# EasyEDA Pro project ProPrj_雁过留痕_2026-07-08.epro, board PCB2
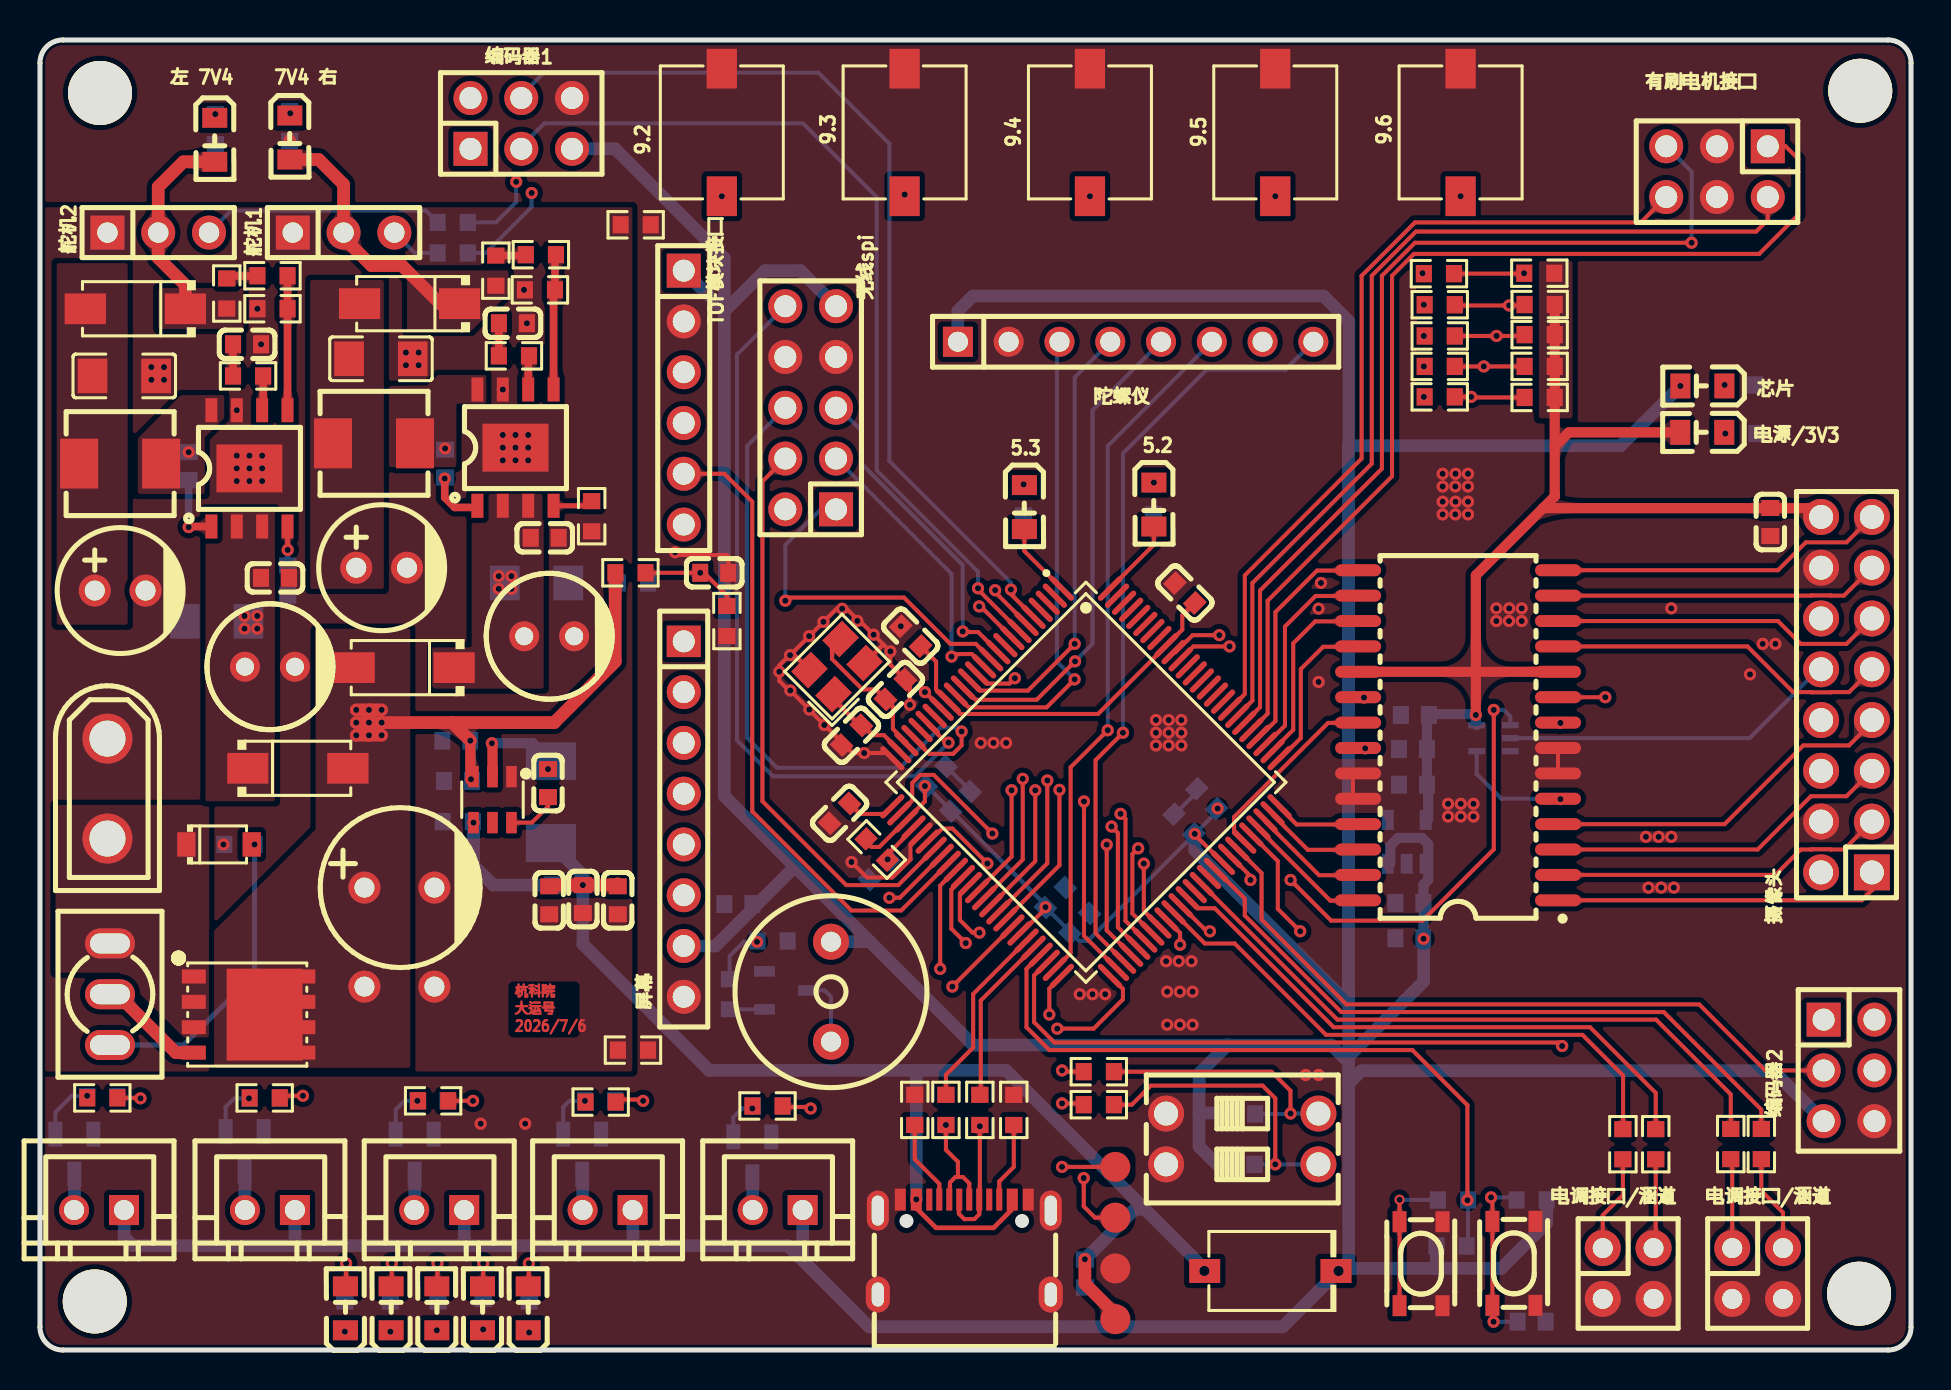
[diagram p4: board, top side]
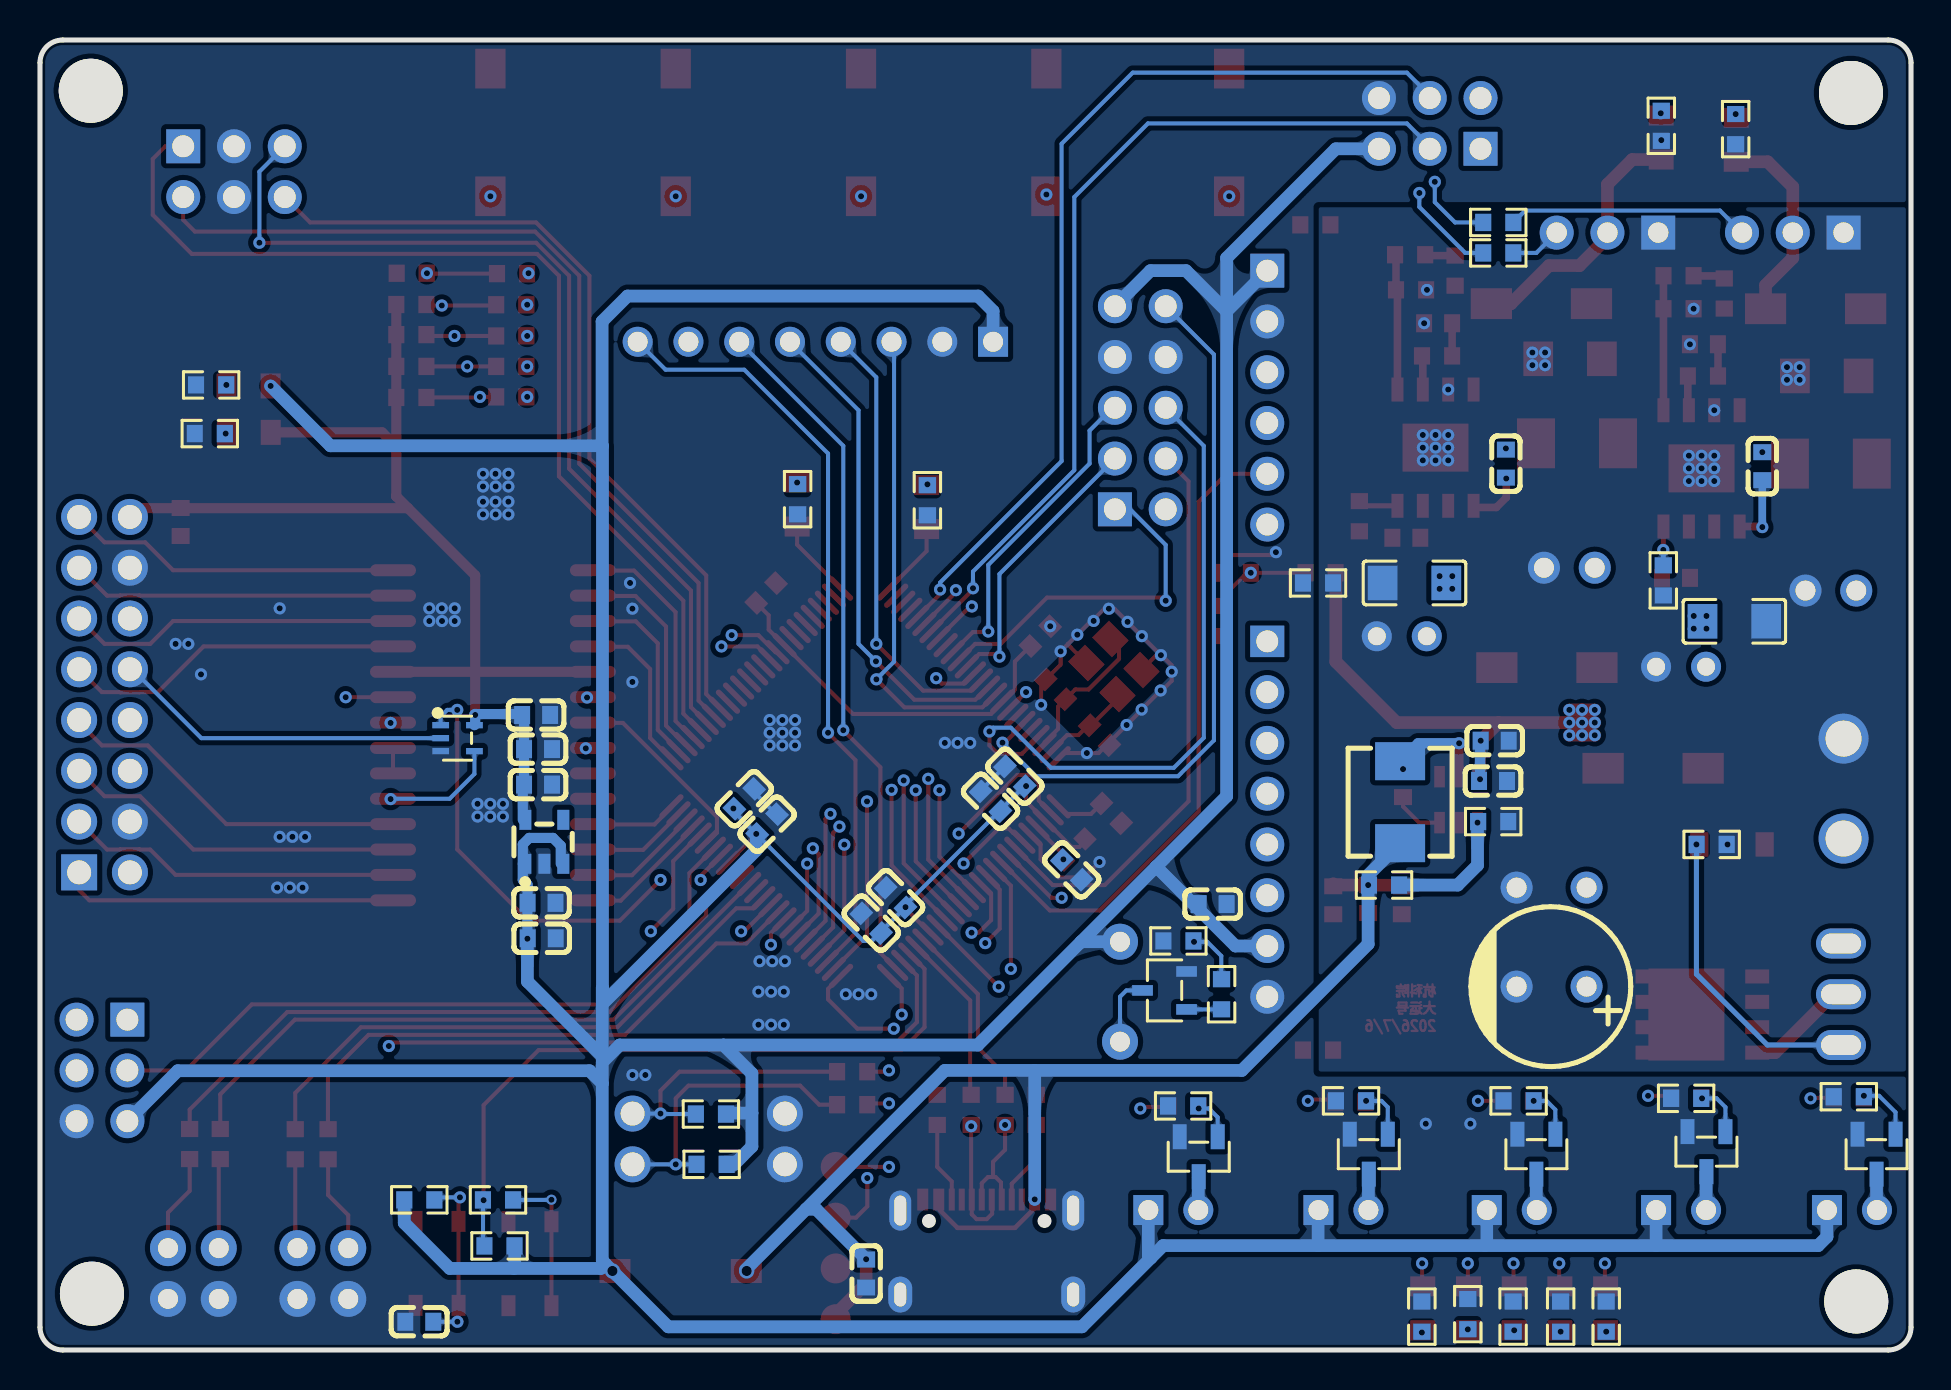
[diagram p5: board, bottom side, seen from below]

Outline 93.6 x 65.53 mm; copper layers: Top Layer, Inner1, Inner2, Bottom Layer. Coordinates in mm from the lower left corner of the outline.
Outline path: 0,64.39 0,1.14 arc(0.33,0.33) 1.14,0 92.46,0 arc(93.26,0.33) 93.6,1.14 93.6,64.39 arc(93.26,65.2) 92.46,65.53 1.14,65.53 arc(0.33,65.2) 0,64.39
Stack: Top Layer 0.035mm Outer layer thickness 1oz / Dielectric1 0.2104mm 7628 RC49% 8.6mil / Inner1 0.0152mm Inner layer thickness / Dielectric2 1.065mm 1.1mm H/HOZ Copper / Inner2 0.0152mm Inner layer thickness / Dielectric3 0.2104mm 7628 RC49% 8.6mil / Bottom Layer 0.035mm Outer layer thickness 1oz

## Design rules (mm)
spacing copperThickness1oz (default): track to track 0.102, other pairs 0.152 to 0.3
spacing copperThickness2oz: track to track 0.203, other pairs 0.152 to 0.3
track width copperThickness1oz (default): min 0.127, default 0.254, max 2.54
track width copperThickness2oz: min 0.203, default 0.254, max 2.54
differential pair differentialPair (default): width min 0.127, default 0.254, max 2.54; gap min 0.152, default 0.152
net VCC7.4V uses copperRegion
net AGND uses copperRegion
net GND uses copperRegion
net VCCBAT uses copperRegion
net $2N48 uses copperRegion
net $2N49 uses copperRegion
net 8.4 uses copperRegion
net 0.0 uses copperRegion
net VCC3V3 uses copperRegion
net $2N1719 uses copperRegion
net $2N1717 uses copperRegion
net $2N1720 uses copperRegion
net VCC7.4 uses copperRegion

## Placement (name value [footprint] x y rotation side)
3V4  -  [LED_0805]  15.28 2.14 90 top
3V5  -  [LED_0805]  24.43 2.14 90 top
3V6  -  [LED_0805]  19.86 2.14 90 top
3V7  -  [LED_0805]  17.57 2.14 90 top
3V8  -  [LED_0805]  22.14 2.14 90 top
5.2  -  [LED_0805]  55.72 42.24 270 top
5.3  -  [LED_0805]  49.24 42.12 270 top
7V4 右  -  [LED_0805]  12.49 60.6 270 top
9.2  TSB06341-050W811WA-R1000  [SW-SMD_L6.0-W6.0-LS6.6]  34.11 60.91 90 top
9.3  TSB06341-050W811WA-R1000  [SW-SMD_L6.0-W6.0-LS6.6]  43.25 60.91 90 top
9.4  TSB06341-050W811WA-R1000  [SW-SMD_L6.0-W6.0-LS6.6]  52.52 60.91 90 top
9.5  TSB06341-050W811WA-R1000  [SW-SMD_L6.0-W6.0-LS6.6]  61.8 60.91 90 top
9.6  TSB06341-050W811WA-R1000  [SW-SMD_L6.0-W6.0-LS6.6]  71.07 60.91 90 top
BUZZER1  3kHz  [BUZ-TH_BD9.6-P5.00-D0.7-FD]  39.57 17.92 270 top
C1  10UF  [C0603]  43.56 35.71 315 top
C2  100nF  [C0603]  41.98 24.02 45 bottom
C3  10uF  [C0603]  46.05 27.45 225 bottom
C4  100nF  [C0603]  44.83 28.7 225 bottom
C5  10uF  [C0603]  58.37 27.58 135 bottom
C6  100nF  [C0603]  57.22 26.31 135 bottom
C7  10UF  [C0603]  40 26.85 45 top
C8  10uF  [C0603]  52.02 21.35 45 bottom
C9  100nF  [C0603]  50.8 22.63 45 bottom
C10  100nF  [C0603]  68.78 31.77 0 bottom
C11  100nF  [C0603_5]  86.56 41.42 90 top
C12  100nF  [C0603]  34.94 22.31 0 bottom
C14  100nF  [C0603_1]  33.73 38.88 180 top
C18  4.7uF  [C1206]  24.84 38.37 0 bottom
C19  100nF  [C0603_3]  25.25 40.63 180 top
C20  100nF  [C0603_3]  20.27 44.34 270 bottom
C21  47uF  [C1206]  17.06 49.58 0 top
C22  4.7nf  [C0603_3]  23.66 51.36 0 top
C23  固态电容220uF  [CAP-TH_BD6.3-P2.50-D1.0-FD]  17.09 39.13 0 top
C24  100uF  [CAP-TH_BD6.3-P2.50-D0.5-FD_NPXC0571C101MF]  25.47 35.7 0 top
C32  100nF  [C0603_3]  68.51 22.37 0 bottom
C33  100nF  [C0603_3]  68.68 30.06 0 bottom
C34  22UF  [C0603_1]  25.47 22.5 90 top
C35  100nF  [C0603_1]  27.16 22.56 90 top
C36  100nF  [C0603_1]  25.41 28.36 270 top
C37  100nF  [C0603_4]  20.91 28.47 0 bottom
C38  100nF  [C0603_4]  20.83 30.48 0 bottom
C39  100nF  [C0603_1]  28.9 22.5 90 top
C44  4.7uF  [C1206]  8.84 36.45 180 bottom
C45  47uF  [C1206]  4.22 48.73 0 top
C46  100nF  [C0603_3]  11.76 38.62 180 top
C47  100nF  [C0603_3]  7.44 44.21 270 bottom
C48  4.7nf  [C0603_3]  10.36 50.31 0 top
C49  固态电容220uF  [CAP-TH_BD6.3-P2.50-D1.0-FD]  4.01 37.99 0 top
C50  100uF  [CAP-TH_BD6.3-P2.50-D0.5-FD_NPXC0571C101MF]  11.5 34.18 0 top
C107  100nF  [C0603_2]  74.62 1.41 180 bottom
C111  10UF  [C0603]  57.27 37.87 315 top
C112  100nF  [C0603_1]  40.59 30.75 225 top
C113  100nF  [C0603_1]  42.8 33.04 225 top
C151  100nF  [C0603_3]  68.68 28.28 0 bottom
C152  100nF  [C0603_1]  52.27 3.83 270 bottom
C153  100nF  [C0603_3]  68.5 20.6 0 bottom
CN1  HX-XH2.54-2PZZ  [CONN-TH_2P-P2.50_HX-2.54MM-2P-ZZ-MS]  19.97 7 180 top
CN2  HX-XH2.54-2PZZ  [CONN-TH_2P-P2.50_HX-2.54MM-2P-ZZ-MS]  2.95 7 180 top
CN3  HX-XH2.54-2PZZ  [CONN-TH_2P-P2.50_HX-2.54MM-2P-ZZ-MS]  11.5 7 180 top
CN4  XT30UPB-M  [CONN-TH_XT30UPB-M]  3.38 28.08 270 top
CN7  HX-XH2.54-2PZZ  [CONN-TH_2P-P2.50_HX-2.54MM-2P-ZZ-MS]  36.9 7 180 top
CN8  HX-XH2.54-2PZZ  [CONN-TH_2P-P2.50_HX-2.54MM-2P-ZZ-MS]  28.39 7 180 top
D1  BZT52C16  [SOD-123_L2.7-W1.6-LS3.7-RD]  8.96 25.29 0 top
D2  SS54  [SMA_L4.4-W2.8-LS5.4-R-RD]  18.22 34.13 180 top
D3  SS54  [SMA_L4.4-W2.8-LS5.4-R-RD]  18.49 52.34 180 top
D6  SS54  [SMA_L4.4-W2.8-LS5.4-R-RD]  12.9 29.1 0 top
D7  SS54  [SMA_L4.4-W2.8-LS5.4-R-RD]  4.77 52.09 180 top
L1  10uH  [IND-SMD_L5.4-W5.2_FXL0530_1]  25.56 27.4 90 bottom
P2  Header-D-M 1x4P  [HDR1X4-TP]  53.79 9.16 270 top
Q1  AO3400A  [SOT-23-3_L2.9-W1.3-P1.90-LS2.4-BR]  18.74 9.8 90 bottom
Q2  AGM30P100A  [PDFN-8_L5.8-W4.9-P1.27-LS6.1-BL-A]  10.49 16.78 270 top
Q3  S8050  [SOT-23-3_L3.0-W1.7-P0.95-LS2.9-BR]  37.34 17.99 180 bottom
Q4  AO3400A  [SOT-23-3_L2.9-W1.3-P1.90-LS2.4-BR]  35.63 9.67 90 bottom
Q5  AO3400A  [SOT-23-3_L2.9-W1.3-P1.90-LS2.4-BR]  27.12 9.8 90 bottom
Q6  AO3400A  [SOT-23-3_L2.9-W1.3-P1.90-LS2.4-BR]  1.72 9.8 90 bottom
Q7  AO3400A  [SOT-23-3_L2.9-W1.3-P1.90-LS2.4-BR]  10.23 9.92 90 bottom
R1  0R  [R0603_3]  41.86 25.04 315 top
R2  10K  [R0603]  12.49 61.24 90 bottom
R3  10K  [R0603_9]  85.1 45.84 180 bottom
R4  10K  [R0603_9]  43.76 12.01 270 top
R5  10K  [R0603]  3.12 12.61 180 top
R6  10K  [R0603_9]  85.04 48.28 180 bottom
R7  470R  [R0603]  70.02 52.29 180 top
R8  470R  [R0603]  70.02 50.73 180 top
R9  470R  [R0603]  70.02 49.2 180 top
R10  470R  [R0603]  70.02 47.68 180 top
R11  22  [R0603]  45.32 12.01 90 top
R12  10K  [R0603_6]  70.61 5.21 180 bottom
R13  100R  [R0603_6]  70.69 7.51 0 bottom
R14  10K  [R0603_9]  48.71 12.01 270 top
R15  22  [R0603]  47.02 12.01 90 top
R16  4.7K  [R0603]  75.02 47.65 180 top
R17  0R  [R0603_3]  29.8 56.29 180 top
R19  4.7K  [R0603]  75.02 50.79 180 top
R21  100R  [R0603]  79.19 10.3 90 top
R22  100R  [R0603]  80.83 10.3 90 top
R23  10K  [R0603]  60.03 11.8 0 bottom
R26  10kΩ  [R0603_8]  9.97 25.29 0 bottom
R27  200K  [R0603]  27.6 41.71 90 top
R28  20K  [R0603]  23.71 49.73 180 top
R29  10K  [R0603_5]  74.62 7.51 180 bottom
R30  1K5  [R0603]  22.81 53.99 90 top
R31  51K  [R0603]  25.06 54.79 0 top
R32  10K  [R0603]  25.01 53.03 180 top
R38  22K  [R0603]  26.36 23.26 0 bottom
R39  3K  [R0603]  20.9 26.43 0 bottom
R40  10K  [R0603]  60 9.29 0 bottom
R41  10K  [R0603]  52.97 13.92 180 top
R42  10K  [R0603]  52.97 12.27 180 top
R43  200K  [R0603]  29.54 38.88 180 top
R44  20K  [R0603]  34.36 36.47 270 top
R46  100  [R0603]  20.65 54.88 0 bottom
R47  4.7K  [R0603]  75.02 49.2 180 top
R48  4.7K  [R0603]  75.02 52.3 180 top
R49  4.7K  [R0603]  75 53.86 180 top
R50  10K  [R0603]  19.67 12.47 180 top
R51  10k  [R0603_2]  19.63 12.46 0 bottom
R52  10K  [R0603]  34.49 17.8 270 bottom
R53  10k  [R0603_2]  36.65 20.46 180 bottom
R54  470R  [R0603]  69.98 53.84 180 top
R61  100  [R0603]  20.65 56.41 0 bottom
R62  100R  [R0603]  84.58 10.3 90 top
R63  100R  [R0603]  86.11 10.3 90 top
R64  200K  [R0603]  12.39 38.5 90 bottom
R65  20K  [R0603]  10.41 48.73 180 top
R66  1K5  [R0603]  9.34 52.85 90 top
R67  51K  [R0603]  11.63 53.74 0 top
R68  10K  [R0603]  11.63 52.09 180 top
R69  10K  [R0603]  8.77 61.07 90 bottom
R70  10k  [R0603_2]  3.11 12.67 0 bottom
R71  10K  [R0603]  11.24 12.61 180 top
R72  10k  [R0603_2]  11.25 12.59 0 bottom
R73  10K  [R0603_9]  49.2 42.51 90 bottom
R74  10K  [R0603_9]  55.7 42.56 90 bottom
R75  10K  [R0603_9]  15.25 1.67 270 bottom
R76  10K  [R0603_9]  17.53 1.67 270 bottom
R77  10K  [R0603_9]  22.17 1.79 270 bottom
R78  10K  [R0603_9]  24.47 1.67 270 bottom
R79  10K  [R0603_9]  19.91 1.67 270 bottom
R80  10K  [R0603]  36.4 12.21 180 top
R81  10k  [R0603_2]  36.41 12.21 0 bottom
R82  10K  [R0603]  28.05 12.4 180 top
R83  10k  [R0603_2]  28.01 12.46 0 bottom
R92  0R  [R0603_3]  29.66 38.37 180 bottom
R193  0R  [R0603_3]  29.66 15 180 top
SCREW1  -  [M3螺丝]  3 62.88 0 top
SCREW2  -  [M3螺丝]  91.06 62.99 0 top
SCREW3  -  [M3螺丝]  2.74 2.43 0 top
SCREW4  -  [M3螺丝]  91 2.82 0 top
SW1  DSWB02LHGET  [SW-TH_DSWB02LHGET]  60.14 10.56 270 top
SW31  TSA016A2526B  [KEY-SMD_4P-L4.2-W3.4-P2.15-LS4.5-TL]  73.73 4.34 90 top
SW44  TS-1089A-B3D4  [KEY-SMD_2P-L6.0-W3.8-LS7.30-L]  61.55 3.95 180 top
SW45  TSA016A2526B  [KEY-SMD_4P-L4.2-W3.4-P2.15-LS4.5-TL]  69.09 4.32 90 top
TOF模块接口  PZ254V-11-06P  [HDR-TH_6P-P2.54-V-M]  32.2 47.64 270 top
U1  STC32G144K246_LQFP100  [STC32G144K246LQFP-100(16x16)]  52.32 28.4 225 top
U3  -  [SOP-28_L17.9-W7.1-P1.27-LS10.3-BL]  70.94 30.75 90 top
U6  ST-0-102-A01-T000-LF+PJ  [SW-TH_3P-L8.3-W5.2-P2.54_ST-0-102-A01-T000]  3.5 17.8 270 top
U9  SCT2450  [ESOP-8_L4.9-W3.9-P1.27-LS6.0-BL-EP]  23.79 45.14 0 top
U10  4.7uH  [IND-SMD_L5.4-W5.2_FXL0530]  16.71 45.36 180 top
U13  RT9013-33GB-MS  [SOT-23-5_L2.9-W1.6-P0.95-LS2.8-BR]  68.37 25.42 270 bottom
U15  470uF  [CAP-TH_BD8.0-P3.50-D0.6-FD]  17.98 18.18 0 bottom
U16  470uF  [CAP-TH_BD8.0-P3.50-D0.6-FD]  17.98 23.13 0 top
U17  TPS54302DDCR  [SOT-23-6_L2.9-W1.6-P0.95-LS2.8-BL]  22.64 27.53 180 top
U18  SN74LVC1G00DCKR  [SOT-353_L2.1-W1.3-P0.65-LS2.3-BR]  72.71 30.61 0 bottom
U20  SCT2450  [ESOP-8_L4.9-W3.9-P1.27-LS6.0-BL-EP]  10.48 44.1 0 top
U21  4.7uH  [IND-SMD_L5.4-W5.2_FXL0530]  4.01 44.34 180 top
USB1  TYPE-C 16PIN 2MD(073)  [USB-C-SMD_TYPE-C-6PIN-2MD-073]  46.24 5.15 0 top
X1  24MHz  [CRYSTAL-SMD_4P-L3.2-W2.5-BL]  39.87 34.19 45 top
屏幕  PM2.54-1X8PM-H85  [HDR-TH_8P-P2.54-V-F]  32.2 26.56 270 top
左 7V4  -  [LED_0805]  8.74 60.49 270 top
摄像头  摄像头  [HDR-TH_16P-P2.54-V-M-R2-C8-S2.54]  90.37 32.78 90 top
无线spi  PZ254V-12-10P  [HDR-TH_10P-P2.54-V-M-R2-C5-S2.54]  38.55 47.13 90 top
有刷电机接口  PZ254V-12-6P  [HDR-TH_6P-P2.54-V-M-R2-C3-S2.54_1]  83.89 58.94 180 top
电源/3V3  -  [LED_0805]  83.11 45.91 180 top
电调接口/涵道  -  [HDR-TH_4P-P2.54-V-F-R2-C2-S2.54]  85.93 3.83 270 top
电调接口/涵道#2  -  [HDR-TH_4P-P2.54-V-F-R2-C2-S2.54]  79.45 3.83 270 top
编码器1  PZ254V-12-6P  [HDR-TH_6P-P2.54-V-M-R2-C3-S2.54_1]  24.08 61.36 0 top
编码器2  PZ254V-12-6P  [HDR-TH_6P-P2.54-V-M-R2-C3-S2.54_1]  90.5 13.99 270 top
舵机1  PZ254V-11-03P  [HDR-TH_3P-P2.54-V-M_PZ254V-11-03P]  15.19 55.9 0 top
舵机2  PZ254V-11-03P  [HDR-TH_3P-P2.54-V-M_PZ254V-11-03P]  5.92 55.9 0 top
芯片  -  [LED_0805]  83.11 48.23 180 top
陀螺仪  陀螺仪  [HDR-TH_8P-P2.54-V-M]  54.81 50.44 0 top

## Footprints (pads in the part's own frame, mm; a bottom-side part is the same pattern mirrored in y, then rotated)
BUZ-TH_BD9.6-P5.00-D0.7-FD
  round 1.8 hole 1: 1(-2.5,0) 2(2.5,0)
C0603
  rect 0.8x0.9 smd: 1(-0.7,0) 2(0.7,0)
C0603_1
  rect 0.8x0.9 smd: 1(-0.7,0) 2(0.7,0)
C0603_2
  rect 0.8x0.9 smd: 1(-0.7,0) 2(0.7,0)
C0603_3
  rect 0.8x0.9 smd: 1(-0.7,0) 2(0.7,0)
C0603_4
  rect 0.8x0.9 smd: 1(-0.7,0) 2(0.7,0)
C0603_5
  rect 0.8x0.9 smd: 1(-0.7,0) 2(0.7,0)
C1206
  rect 1.485x1.728 smd: 1(-1.593,0) 2(1.593,0)
CAP-TH_BD6.3-P2.50-D0.5-FD_NPXC0571C101MF
  round 1.5 hole 0.9: 1(-1.25,0) 2(1.25,0)
CAP-TH_BD6.3-P2.50-D1.0-FD
  round 1.6 hole 1: 1(-1.27,0) 2(1.27,0)
CAP-TH_BD8.0-P3.50-D0.6-FD
  round 1.6 hole 1: 1(-1.75,0) 2(1.75,0)
CONN-TH_2P-P2.50_HX-2.54MM-2P-ZZ-MS
  rect 1.5x1.5 hole 1: 1(-1.25,0)
  round 1.5 hole 1: 2(1.25,0)
CONN-TH_XT30UPB-M
  round 2.5 hole 1.8: 1(-2.5,0) 2(2.5,0)
CRYSTAL-SMD_4P-L3.2-W2.5-BL
  rect 1.4x1.2 smd: 1(-1.1,-0.85) 2(1.1,-0.85) 3(1.1,0.85) 4(-1.1,0.85)
ESOP-8_L4.9-W3.9-P1.27-LS6.0-BL-EP
  rect 0.6x1.2 smd: 1(-1.905,-2.909) 2(-0.635,-2.909) 3(0.635,-2.909) 4(1.905,-2.909) 5(1.905,2.909) 6(0.635,2.909) 7(-0.635,2.909) 8(-1.905,2.909)
  rect 3.3x2.4 smd: 9(0,0)
HDR1X4-TP
  rrect 1.5x1.5 smd: 1(0,0)
  round 1.5 smd: 2(2.54,0) 3(5.08,0) 4(7.62,0)
HDR-TH_3P-P2.54-V-M_PZ254V-11-03P
  rect 1.7x1.7 hole 1.02: 1(-2.54,0)
  round 1.7 hole 1.02: 2(0,0) 3(2.54,0)
HDR-TH_4P-P2.54-V-F-R2-C2-S2.54
  round 1.8 hole 1: 1(-1.27,-1.27) 2(-1.27,1.27) 3(1.27,-1.27) 4(1.27,1.27)
HDR-TH_6P-P2.54-V-M
  rect 1.7x1.7 hole 1.1: 1(-6.35,0)
  round 1.7 hole 1.1: 2(-3.81,0) 3(-1.27,0) 4(1.27,0) 5(3.81,0) 6(6.35,0)
HDR-TH_6P-P2.54-V-M-R2-C3-S2.54_1
  rect 1.7x1.7 hole 1.1: 1(-2.54,-1.27)
  round 1.7 hole 1.1: 2(-2.54,1.27) 3(0,-1.27) 4(0,1.27) 5(2.54,-1.27) 6(2.54,1.27)
HDR-TH_8P-P2.54-V-F
  rect 1.575x1.7 hole 1.1: 1(-8.89,0)
  round 1.7 hole 1.1: 2(-6.35,0) 3(-3.81,0) 4(-1.27,0) 5(1.27,0) 6(3.81,0) 7(6.35,0) 8(8.89,0)
HDR-TH_8P-P2.54-V-M
  rect 1.5x1.5 hole 1: 1(-8.89,0)
  round 1.5 hole 1: 2(-6.35,0) 3(-3.81,0) 4(-1.27,0) 5(1.27,0) 6(3.81,0) 7(6.35,0) 8(8.89,0)
HDR-TH_10P-P2.54-V-M-R2-C5-S2.54
  rect 1.7x1.7 hole 1.1: 1(-5.08,-1.27)
  round 1.7 hole 1.1: 2(-5.08,1.27) 3(-2.54,-1.27) 4(-2.54,1.27) 5(0,-1.27) 6(0,1.27) 7(2.54,-1.27) 8(2.54,1.27) 9(5.08,-1.27) 10(5.08,1.27)
HDR-TH_16P-P2.54-V-M-R2-C8-S2.54
  rect 1.8x1.8 hole 1.2: 1(-8.89,-1.27)
  round 1.8 hole 1.2: 2(-8.89,1.27) 3(-6.35,-1.27) 4(-6.35,1.27) 5(-3.81,-1.27) 6(-3.81,1.27) 7(-1.27,-1.27) 8(-1.27,1.27) 9(1.27,-1.27) 10(1.27,1.27) 11(3.81,-1.27) 12(3.81,1.27) 13(6.35,-1.27) 14(6.35,1.27) 15(8.89,-1.27) 16(8.89,1.27)
IND-SMD_L5.4-W5.2_FXL0530
  rect 1.9x2.5 smd: 1(-2.05,0) 2(2.05,0)
IND-SMD_L5.4-W5.2_FXL0530_1
  rect 1.9x2.5 smd: 1(-2.05,0) 2(2.05,0)
KEY-SMD_2P-L6.0-W3.8-LS7.30-L
  rect 1.55x1.2 smd: 1(3.285,0) 2(-3.285,0)
KEY-SMD_4P-L4.2-W3.4-P2.15-LS4.5-TL
  rect 1.05x0.7 smd: 1(-2.1,1.075) 2(2.1,1.075) 3(-2.1,-1.075) 4(2.1,-1.075)
LED_0805
  rect 1x1.25 smd: 1(-1.15,0.005) 2(1.05,0.005)
M3螺丝
  round 3.2 hole 3.2: 1(0,0)
PDFN-8_L5.8-W4.9-P1.27-LS6.1-BL-A
  rect 0.7x1.2 smd: 1(-1.905,-2.792) 2(-0.635,-2.792) 3(0.635,-2.792) 4(1.905,-2.792)
  rect 0.7x1 smd: 5(1.905,2.792) 6(0.635,2.792) 7(-0.635,2.792) 8(-1.905,2.792)
  rect 4.6x3.8 smd: 9(0,0.75)
R0603
  rect 0.806x0.864 smd: 1(-0.753,0) 2(0.753,0)
R0603_2
  rect 0.806x0.864 smd: 1(-0.753,0) 2(0.753,0)
R0603_3
  rect 0.806x0.864 smd: 1(-0.753,0) 2(0.753,0)
R0603_5
  rect 0.806x0.864 smd: 1(-0.753,0) 2(0.753,0)
R0603_6
  rect 0.806x0.864 smd: 1(-0.753,0) 2(0.753,0)
R0603_8
  rect 0.806x0.864 smd: 1(-0.753,0) 2(0.753,0)
R0603_9
  rect 0.806x0.864 smd: 1(-0.753,0) 2(0.753,0)
SMA_L4.4-W2.8-LS5.4-R-RD
  rect 2.062x1.539 smd: 1(2.503,0) 2(-2.503,0)
SOD-123_L2.7-W1.6-LS3.7-RD
  rect 0.91x1.22 smd: 1(-1.635,0) 2(1.635,0)
SOP-28_L17.9-W7.1-P1.27-LS10.3-BL
  oval 0.6x2.3 smd: 1(-8.255,-5) 2(-6.985,-5) 3(-5.715,-5) 4(-4.445,-5) 5(-3.175,-5) 6(-1.905,-5) 7(-0.635,-5) 8(0.635,-5) 9(1.905,-5) 10(3.175,-5) 11(4.445,-5) 12(5.715,-5) 13(6.985,-5) 14(8.255,-5) 15(8.255,5) 16(6.985,5) 17(5.715,5) 18(4.445,5) 19(3.175,5) 20(1.905,5) 21(0.635,5) 22(-0.635,5) 23(-1.905,5) 24(-3.175,5) 25(-4.445,5) 26(-5.715,5) 27(-6.985,5) 28(-8.255,5)
SOT-23-3_L2.9-W1.3-P1.90-LS2.4-BR
  rect 1.25x0.7 smd: 1(1,-0.95) 2(1,0.95) 3(-1,0)
SOT-23-3_L3.0-W1.7-P0.95-LS2.9-BR
  rect 1.038x0.532 smd: 1(1.101,-0.95) 2(1.101,0.95) 3(-1.101,0)
SOT-23-5_L2.9-W1.6-P0.95-LS2.8-BR
  rect 1x0.6 smd: 1(1.1,-0.95) 2(1.1,0) 3(1.1,0.95) 4(-1.1,0.95) 5(-1.1,-0.95)
SOT-23-6_L2.9-W1.6-P0.95-LS2.8-BL
  rect 0.532x1.072 smd: 1(-0.95,-1.149) 2(0,-1.149) 3(0.95,-1.149) 4(0.95,1.149) 5(0,1.149) 6(-0.95,1.149)
SOT-353_L2.1-W1.3-P0.65-LS2.3-BR
  rect 0.839x0.315 smd: 1(0.845,-0.65) 2(0.845,0) 3(0.845,0.65) 4(-0.845,0.65) 5(-0.845,-0.65)
STC32G144K246LQFP-100(16x16)
  oval 0.28x1.6 smd: 1(-6,-7.7) 2(-5.5,-7.7) 3(-5,-7.7) 4(-4.5,-7.7) 5(-4,-7.7) 6(-3.5,-7.7) 7(-3,-7.7) 8(-2.5,-7.7) 9(-2,-7.7) 10(-1.5,-7.7) 11(-1,-7.7) 12(-0.5,-7.7) 13(0,-7.7) 14(0.5,-7.7) 15(1,-7.7) 16(1.5,-7.7) 17(2,-7.7) 18(2.5,-7.7) 19(3,-7.7) 20(3.5,-7.7) 21(4,-7.7) 22(4.5,-7.7) 23(5,-7.7) 24(5.5,-7.7) 25(6,-7.7) 51(6,7.7) 52(5.5,7.7) 53(5,7.7) 54(4.5,7.7) 55(4,7.7) 56(3.5,7.7) 57(3,7.7) 58(2.5,7.7) 59(2,7.7) 60(1.5,7.7) 61(1,7.7) 62(0.5,7.7) 63(0,7.7) 64(-0.5,7.7) 65(-1,7.7) 66(-1.5,7.7) 67(-2,7.7) 68(-2.5,7.7) 69(-3,7.7) 70(-3.5,7.7) 71(-4,7.7) 72(-4.5,7.7) 73(-5,7.7) 74(-5.5,7.7) 75(-6,7.7)
  oval 1.6x0.28 smd: 26(7.7,-6) 27(7.7,-5.5) 28(7.7,-5) 29(7.7,-4.5) 30(7.7,-4) 31(7.7,-3.5) 32(7.7,-3) 33(7.7,-2.5) 34(7.7,-2) 35(7.7,-1.5) 36(7.7,-1) 37(7.7,-0.5) 38(7.7,0) 39(7.7,0.5) 40(7.7,1) 41(7.7,1.5) 42(7.7,2) 43(7.7,2.5) 44(7.7,3) 45(7.7,3.5) 46(7.7,4) 47(7.7,4.5) 48(7.7,5) 49(7.7,5.5) 50(7.7,6) 76(-7.7,6) 77(-7.7,5.5) 78(-7.7,5) 79(-7.7,4.5) 80(-7.7,4) 81(-7.7,3.5) 82(-7.7,3) 83(-7.7,2.5) 84(-7.7,2) 85(-7.7,1.5) 86(-7.7,1) 87(-7.7,0.5) 88(-7.7,0) 89(-7.7,-0.5) 90(-7.7,-1) 91(-7.7,-1.5) 92(-7.7,-2) 93(-7.7,-2.5) 94(-7.7,-3) 95(-7.7,-3.5) 96(-7.7,-4) 97(-7.7,-4.5) 98(-7.7,-5) 99(-7.7,-5.5) 100(-7.7,-6)
SW-SMD_L6.0-W6.0-LS6.6
  rect 1.985x1.512 smd: 1(-3.192,0) 2(3.192,0)
SW-TH_3P-L8.3-W5.2-P2.54_ST-0-102-A01-T000
  oval 1.5x2.5 hole 1x2: 1(-2.54,0) 2(0,0) 3(2.54,0)
SW-TH_DSWB02LHGET
  round 1.8 hole 1.2: 1(-1.27,3.81) 2(1.27,3.81) 3(-1.27,-3.81) 4(1.27,-3.81)
USB-C-SMD_TYPE-C-6PIN-2MD-073
  rect 0.55x1.1 smd: 1(-3.2,2.375) 2(-2.4,2.375) 11(2.4,2.375) 12(3.2,2.375)
  rect 0.3x1.1 smd: 3(-1.75,2.375) 4(-1.25,2.375) 5(-0.75,2.375) 6(-0.25,2.375) 7(0.25,2.375) 8(0.75,2.375) 9(1.25,2.375) 10(1.75,2.375)
  oval 1.1x2 hole 0.6x1.5: 13(-4.325,1.825) 14(4.325,1.825)
  oval 1.2x1.8 hole 0.6x1.2: 13(-4.325,-2.375) 14(4.325,-2.375)

## Nets
5V_CORE: C34.2 C35.2 C39.2 C152.1 L1.1 P2.4 R38.2 SW44.1 USB1.2 USB1.11
AGND: 9.2.2 9.3.2 9.4.2 9.5.2 9.6.2 C1.1 C2.1 C3.1 C4.1 C5.2 C6.2 C7.1 C8.2 C9.2 C10.1 C11.1 C12.1 C14.1 C32.1 C33.1 C107.1 C111.1 C112.2 C113.1 C151.1 C152.2 C153.1 P2.3 Q1.2 Q3.2 Q4.2 Q5.2 Q6.2 Q7.2 R2.1 R3.1 R4.1 R6.1 R14.1 R17.1 R44.2 R51.2 R53.1 R69.1 R70.2 R72.2 R73.1 R74.1 R75.1 R76.1 R77.1 R78.1 R79.1 R81.2 R83.2 R92.1 R193.1 SW1.3 SW1.4 SW31.3 SW31.4 SW45.3 SW45.4 TOF模块接口.2 U1.25 U1.30 U3.6 U3.7 U3.23 U3.24 U13.2 U18.3 USB1.1 USB1.12 USB1.13 USB1.14 X1.2 X1.4 屏幕.8 摄像头.4 摄像头.14 无线spi.7 无线spi.8 有刷电机接口.3 有刷电机接口.4 电调接口/涵道.3 电调接口/涵道.4 电调接口/涵道#2.3 电调接口/涵道#2.4 编码器1.6 编码器2.6 陀螺仪.2
GND: C18.2 C19.1 C21.2 C22.2 C23.2 C24.2 C34.1 C35.1 C37.1 C38.1 C39.1 C44.2 C45.2 C46.1 C48.2 C49.2 C50.2 CN4.1 R17.2 R26.1 R27.1 R32.2 R39.1 R64.1 R68.2 R92.2 R193.2 U9.7 U9.9 U15.2 U16.2 U17.1 U20.7 U20.9 舵机1.1 舵机2.1
VCC3V3: C10.2 C11.2 C33.2 C151.2 R16.1 R19.1 R47.1 R48.1 R49.1 U3.10 U3.19 U13.5 U18.5 摄像头.16 电源/3V3.2
VCC7.4: D7.2 R66.1 左 7V4.2 舵机2.2
VCC7.4V: 7V4 右.2 D3.2 R30.1 舵机1.2
VCCBAT: C37.2 C38.2 D2.1 D6.1 Q2.5 Q2.6 Q2.7 Q2.8 Q2.9 R43.2 U15.1 U16.1 U17.3
VCCIC: BUZZER1.1 C3.2 C4.2 C5.1 C6.1 C8.1 C9.1 C12.2 C32.2 C153.2 CN1.1 CN2.1 CN3.1 CN7.1 CN8.1 R1.1 R12.2 R23.1 R29.1 R40.1 SW44.2 TOF模块接口.1 U1.28 U1.44 U1.67 U13.1 U13.3 屏幕.7 无线spi.9 编码器1.5 编码器2.5 芯片.2 陀螺仪.1
0.0: U1.95
0.4: U1.99
0.5: U1.2
0.6: U1.3
0.7: U1.4
1.0: C14.2 R43.1 R44.1 U1.18
1.5: U1.22 无线spi.6
2.0: U1.72 U3.28
2.1: U1.73 U3.27
2.2: U1.74 U3.26
2.3: U1.75 U3.25
2.4: U1.76 U3.18
2.5: U1.77 U3.17
2.6: U1.78 U3.16
2.7: U1.79 U3.15
3.3: U1.48 摄像头.12
3.4: U1.49 陀螺仪.6
3.5: U1.52 屏幕.2
3.6: U1.53 陀螺仪.8
3.7: U1.54 U3.20
4.0: U1.31 编码器2.4
4.1: U1.68 U18.1
4.2: U1.69 编码器2.3
4.3: U1.70 U3.21
4.4: 3V4.2 R5.1 U1.71
4.6: U1.94
4.7: U1.20 无线spi.10
5.0: 3V8.2 R82.1 U1.50
5.1: 3V5.2 R80.1 U1.51
5.2: 5.2.2 U1.100
5.3: 5.3.2 U1.1
6.0: U1.5 编码器1.4
6.1: TOF模块接口.3 U1.6
6.2: U1.7 编码器1.3
6.3: TOF模块接口.4 U1.8
6.4: U1.32 无线spi.4
6.5: R52.1 R53.2 U1.33
6.6: TOF模块接口.5 U1.34
6.7: 3V7.2 R71.1 U1.35
7.0: U1.55 屏幕.4
7.1: U1.56 屏幕.3
7.2: U1.57 U3.22
7.3: U1.58 U3.8
7.4: U1.80 有刷电机接口.1
7.5: U1.81 有刷电机接口.5
7.6: U1.82 有刷电机接口.2
7.7: U1.83 有刷电机接口.6
8.0: U1.9
8.1: U1.10 屏幕.5 无线spi.5
8.2: U1.11 屏幕.1 无线spi.1
8.3: U1.12 屏幕.6 无线spi.3
8.4: TOF模块接口.6 U1.13
8.5: U1.14 陀螺仪.4
8.6: U1.15 陀螺仪.5
8.7: U1.16 陀螺仪.3
9.0: R41.2 U1.36
9.1: R42.2 U1.37
9.2: R54.2 U1.38
9.3: R7.2 U1.39
9.4: R8.2 U1.40
9.5: R9.2 U1.41
9.6: R10.2 U1.42
9.7: 3V6.2 R50.1 U1.43
A.0: R46.2 U1.59
A.1: R21.2 U1.60
A.2: R61.2 U1.61
A.3: R22.2 U1.62
A.5: R62.2 U1.64
A.7: R63.2 U1.66
B.6: U1.90 摄像头.6
B.7: U1.91 摄像头.8
CC1: R4.2 USB1.4
CC2: R14.2 USB1.10
CORE_VCC: C1.2 C111.2 U1.17 U1.92
D+: P2.2 R15.1 USB1.6 USB1.8
D-: P2.1 R11.1 USB1.5 USB1.7
FB3: R38.1 R39.2 U17.4
HREF: U18.2 摄像头.10
P1.6: C113.2 U1.23 X1.3
P1.7: C112.1 U1.24 X1.1
P3.0: R11.2 U1.45
P3.1: R15.2 U1.46
P3.2: R12.1 R13.2 U1.47
P5.4: C107.2 R29.2 SW31.1 SW31.2 U1.27
PCLK: U3.9 摄像头.2
UCAP: C7.2 U1.26
VREF: C2.2 R1.2 U1.29
WE: U3.5 U18.4
$1N37511: R13.1 SW45.1 SW45.2
$2N8: C36.2 U17.6
$2N11: C36.1 L1.2 U17.2
$2N35: R30.2 R31.1
$2N37: C22.1 R28.2
$2N38: C21.1 C23.1 D3.1 U10.2
$2N39: C20.1 U9.8 U10.1
$2N40: R28.1 U9.6
$2N41: R31.2 R32.1 U9.5
$2N42: R27.2 U9.4
$2N43: C20.2 U9.1
$2N45: C18.1 C19.2 C24.1 D2.2 U9.2 U9.3
$2N48: CN4.2 D1.1 Q2.1 Q2.2 Q2.3 U6.1
$2N49: D1.2 R26.2 U6.3
$2N1711: R66.2 R67.1
$2N1712: R65.1 U20.6
$2N1713: R67.2 R68.1 U20.5
$2N1714: R64.2 U20.4
$2N1715: C48.1 R65.2
$2N1716: C47.2 U20.1
$2N1717: C47.1 U20.8 U21.1
$2N1719: C45.1 C49.1 D7.1 U21.2
$2N1720: C44.1 C46.2 C50.1 D6.2 U20.2 U20.3
$2N1728: Q2.4 U6.2
$3N54: CN1.2 Q1.3
$3N83: R46.1 舵机1.3
$3N93: R22.1 电调接口/涵道#2.2
$3N95: R21.1 电调接口/涵道#2.1
$3N132: Q1.1 R50.2 R51.1
$3N199: CN7.2 Q4.3
$3N202: Q4.1 R80.2 R81.1
$3N204: CN8.2 Q5.3
$3N207: Q5.1 R82.2 R83.1
$3N271: 9.2.1 R49.2 R54.1
$3N278: 9.3.1 R7.1 R48.2
$3N279: 9.4.1 R8.1 R19.2
$3N280: 9.5.1 R9.1 R47.2
$3N281: 9.6.1 R10.1 R16.2
$3N297: R61.1 舵机2.3
$3N300: R63.1 电调接口/涵道.2
$3N302: R62.1 电调接口/涵道.1
$3N307: CN2.2 Q6.3
$3N309: Q6.1 R5.2 R70.1
$3N312: CN3.2 Q7.3
$3N314: Q7.1 R71.2 R72.1
$3N325: 3V4.1 R75.2
$3N327: 3V7.1 R76.2
$3N329: 3V8.1 R77.2
$3N331: 3V5.1 R78.2
$3N333: 3V6.1 R79.2
$4N26: U3.14 摄像头.15
$4N27: U3.13 摄像头.13
$4N29: U3.12 摄像头.11
$4N31: U3.11 摄像头.9
$4N33: U3.4 摄像头.7
$4N35: U3.3 摄像头.5
$4N37: U3.2 摄像头.3
$4N39: U3.1 摄像头.1
$4N50: R40.2 R42.1 SW1.2
$4N51: R23.2 R41.1 SW1.1
$4N55: Q3.1 R52.2
$4N56: BUZZER1.2 Q3.3
$4N65: 5.3.1 R73.2
$4N66: R6.2 芯片.1
$4N67: R3.2 电源/3V3.1
$4N68: 7V4 右.1 R2.2
$4N269: R69.2 左 7V4.1
$4N275: 5.2.1 R74.2

Pads without a net: SCREW1 1; SCREW2 1; SCREW3 1; SCREW4 1; U1 19 21 63 65 84 85 86 87 88 89 93 96 97 98; U13 4; U17 5; USB1 3 9; 无线spi 2; 编码器1 1 2; 编码器2 1 2; 陀螺仪 7

## Via types
v1: diameter 0.61, hole 0.305, Top Layer to Bottom Layer, 261 vias
v2: diameter 0.762, hole 0.508, Top Layer to Bottom Layer, 2 vias
v3: diameter 0.508, hole 0.305, Top Layer to Bottom Layer, 1 via

## Routing (per net, layer and track width the routed paths; a pad name or vN(x,y) marks a point on that pad's centre or on a via; arc(x,y) is an arc through that point)
5V_CORE: length 67.3
  Top Layer w0.229: 48.57,6.98 47.7,6.11 44.82,6.11 43.84,7.1 USB1.2
  Top Layer w0.635: 28.9,23.32 28.84,23.26 v1(27.16,23.26) 25.54,23.26 C34.2 ; 54.05,1.54 52.27,3.32 v1(52.27,4.54)
  Bottom Layer w0.635: 43.84,13.99 48.33,13.99 55.28,7.04 ; 43.84,13.99 33.47,13.99 27.16,20.3 v1(27.16,23.26) 27.16,23.75 L1.1 ; 43.84,13.99 v1(43.84,7.54) ; 55.28,7.04 54.77,7.04 v1(52.27,4.54) ; 55.28,7.04 58.31,4.01
  vias: v2(58.25,3.95)
AGND: length 36
  Top Layer w0.203: v1(40.59,24.41) 41.37,23.64 42.64,23.64 43.54,24.54 43.54,25.28 44.05,25.78 ; U3.7 U3.6 ; 42.17,35.32 42.17,35.28 X1.2 ; 42.17,35.32 v1(41.71,35.78) 41.02,36.47 v1(40.89,36.47) 40.89,36.54 40.35,37.08 39.85,37.08 v1(39.19,36.43) v1(38.48,35.71) v1(37.52,34.76) ; 42.17,35.32 v1(42.54,34.95) 42.54,34.29 43.16,33.67 ; v1(43.52,32.28) 43.52,33.31 43.29,33.54 ; 65.68,27.56 65.68,28.83 ; v1(37.52,34.76) 37.49,34.76 36.98,34.25 v1(36.98,33.93) 36.98,33.47 37.46,32.99 v1(37.54,32.99) 38.49,32.04 v1(38.49,32.04) 38.49,32.02 v1(39.24,31.27) 40.64,29.86 v1(41.23,29.86) 42.38,29.86 U1.25 ; v1(37.52,34.76) 37.75,34.76 X1.4 ; v1(31.77,39.91) 31.91,39.77 34.36,39.77 34.43,39.7 C14.1
  Bottom Layer w0.203: 56.78,26.81 58.05,28.08 ; 45.33,29.2 46.54,27.98 C3.1
  vias: v1(12.49,60.52) v1(22.04,11.32) v1(24.27,11.32) v1(40.13,37.08) v1(43.06,36.2) v1(47.06,30.37) v1(47.7,30.37) v1(48.33,30.37) v1(52.02,17.8) v1(52.65,17.8) v1(53.29,17.8) v1(55.83,31.51) v1(55.83,30.88) v1(55.83,30.24) v1(56.33,19.45) v1(56.39,17.92) v1(56.39,16.27) v1(56.46,31.51) v1(56.46,30.88) v1(56.46,30.24) v1(56.97,19.45) v1(57.02,17.92) v1(57.02,16.27) v1(57.1,31.51) v1(57.1,30.88) v1(57.1,30.24) v1(57.6,19.45) v1(57.66,17.92) v1(57.66,16.27) v1(63.32,13.76) v1(63.96,37.08) v1(63.96,33.42) v1(63.96,13.76) v1(64.08,38.37) v1(70.17,43.83) v1(70.17,43.2) v1(70.17,42.44) v1(70.17,41.8) v1(70.44,27.32) v1(70.44,26.69) v1(70.81,43.83) v1(70.8,43.2) v1(70.81,42.44) v1(70.8,41.8) v1(71.08,27.32) v1(71.08,26.69) v1(71.44,43.83) v1(71.44,43.2) v1(71.44,42.44) v1(71.44,41.8) v1(71.71,27.32) v1(71.71,26.69) v1(72.85,37.1) v1(72.85,36.47) v1(73.49,36.47) v1(73.5,37.1) v1(74.12,37.1) v1(74.12,36.47) v1(80.34,25.67) v1(80.46,23.13) v1(80.97,25.67) v1(81.1,23.13) v1(81.61,37.1) v1(81.61,25.67) v1(81.73,23.13) v1(85.54,33.8) v1(86.18,35.32) v1(86.81,35.32)
GND:
  vias: v1(5.57,49.17) v1(5.57,48.53) v1(6.21,49.17) v1(6.21,48.53) v1(9.18,25.29) v1(9.84,47.01) v1(9.84,44.74) v1(9.84,44.1) v1(9.84,43.47) v1(10.48,44.74) v1(10.48,44.1) v1(10.48,43.47) v1(10.88,52.09) v1(11.06,50.31) v1(11.11,44.74) v1(11.11,44.1) v1(11.11,43.47) v1(18.31,49.9) v1(18.31,49.26) v1(18.94,49.9) v1(18.94,49.26) v1(23.15,48.05) v1(23.15,45.77) v1(23.15,45.14) v1(23.15,44.5) v1(23.79,45.77) v1(23.79,45.14) v1(23.79,44.5) v1(24.21,53.03) v1(24.36,51.36) v1(24.42,45.77) v1(24.42,45.14) v1(24.42,44.5)
VCC3V3: length 61
  Top Layer w0.508: U3.19 71.83,33.93 ; 71.83,33.93 v1(71.83,31.77) ; 71.83,33.93 71.83,38.75 75.19,42.11 ; 75.77,45.2 76.48,45.9 82.05,45.9 ; 75.77,45.2 75.77,42.71 75.78,42.71 75.19,42.11 ; 75.77,45.2 R16.1 R47.1 R19.1 R48.1 ; U3.10 71.89,33.93 ; 75.19,42.11 88.66,42.11 摄像头.16
  Bottom Layer w0.508: 71.87,31.26 71.83,31.3 v1(71.83,31.77) 71.78,31.81 69.59,31.81 69.38,31.61 C33.2 C151.2 69.45,28.22 69.45,26.52
VCC7.4: length 10
  Top Layer w0.635: 8.74,59.44 7.17,59.44 5.92,58.18 舵机2.2 5.92,54.63 7.28,53.27 7.28,52.09
VCC7.4V: length 13
  Top Layer w0.635: 7V4 右.2 13.94,59.55 15.19,58.31 舵机1.2 15.19,55.64 16.58,54.25 18.11,54.25 20.01,52.34 D3.2
VCCBAT: length 27.5
  Top Layer w0.508: v1(21.53,30.48) 21.53,28.58 v1(21.56,28.55)
  Top Layer w0.635: v1(21.53,30.48) 20.65,31.36 20.65,31.39 ; 16.58,31.39 v1(17.09,31.39) 20.65,31.39 ; v1(16.46,30.75) v1(16.46,31.39) ; v1(16.46,30.75) v1(15.82,30.75) ; v1(16.46,30.75) v1(17.09,30.75) ; v1(16.46,31.39) v1(15.82,31.39) ; v1(16.46,31.39) v1(16.46,32.02) ; 20.65,31.39 25.73,31.39 28.78,34.43 28.78,38.87 R43.2 ; v1(17.09,32.02) v1(16.46,32.02) ; v1(16.46,32.02) v1(15.82,32.02)
  Bottom Layer w0.508: v1(21.56,28.55) 21.56,30.45 v1(21.53,30.48)
VCCIC: length 356.9
  Top Layer w0.203: v1(57.77,25.82) 57.77,25.78 59.18,24.37 ; v1(50.3,22.15) 50.3,22.08 49,20.78 ; 41.2,25.57 41.6,25.16 41.98,25.16 44.27,27.45 v1(44.27,28.21)
  Bottom Layer w0.203: 57.72,25.77 52.41,20.46 51.99,20.46 v1(50.3,22.15) 50.3,22.26 44.33,28.23 ; v1(57.77,25.82) 58.91,26.96 v1(58.91,27.09)
  Bottom Layer w0.508: 67.55,24.32 67.55,25.22 67.94,25.62 69.12,25.62 69.45,25.3 69.45,24.32 ; 69.45,24.32 69.45,23.52 69.21,23.28 C32.2 69.21,22.36 v1(69.21,20.57)
  Bottom Layer w0.635: 陀螺仪.1 45.92,51.97 46.67,52.72 64.21,52.72 65.48,51.45 65.48,45.23 ; 34.24,51.96 34.24,54.63 28.78,60.09 26.49,60.09 ; 34.24,51.96 TOF模块接口.1 ; 34.24,51.96 34.24,27.7 37.76,24.18 ; 34.24,51.96 36.27,53.99 38.05,53.99 无线spi.9 ; 65.48,45.23 65.46,45.21 65.46,18.13 65.47,18.11 65.47,17.3 ; 65.48,45.23 79.07,45.23 v1(82.06,48.23) ; 65.47,13.33 65.47,4.46 65.31,4.31 ; 65.47,13.33 65.47,14.39 ; 65.47,13.33 66.11,13.97 86.7,13.97 编码器2.5 ; CN7.1 38.15,4.73 38.03,4.6 ; 38.03,4.6 37.41,5.22 29.66,5.22 ; 38.03,4.6 41.48,1.16 62.17,1.16 v2(64.96,3.95) 65.31,4.31 ; 65.31,4.31 65.54,4.08 69.89,4.08 ; 41.52,20.42 37.76,24.18 ; 41.52,20.42 46.68,15.26 59.41,15.26 ; 41.52,20.42 BUZZER1.1 ; 37.76,24.18 33.79,20.21 屏幕.7 ; 59.41,15.26 57.99,13.83 57.99,11.85 ; 59.41,15.26 64.6,15.26 65.47,14.39 ; R29.1 75.38,6.36 73.1,4.08 69.89,4.08 ; R23.1 59.23,11.85 57.99,11.85 ; 21.32,5.22 4.65,5.22 4.2,5.66 CN2.1 ; 21.32,5.22 29.66,5.22 ; 21.32,5.22 21.22,5.32 CN1.1 ; 65.47,17.3 65.47,14.69 ; 65.47,17.3 57.77,25 v1(57.77,25.82) ; 65.47,14.69 69.21,18.43 v1(69.21,20.57) ; 65.47,14.69 65.47,14.39 ; CN3.1 12.75,5.23 ; 69.89,4.08 69.85,4.12 69.85,5.21 ; 57.99,11.85 57.99,10.18 58.87,9.29 R40.1 ; CN8.1 29.66,6.99 29.66,5.22
1.0: length 21.7
  Top Layer w0.203: R43.1 v1(33.03,38.88) 33.22,38.88 34.36,37.74 R44.1 ; v1(44.27,32.91) 44.28,32.91 U1.18
  Inner1 w0.203: v1(44.27,32.91) 44.27,35.83 41.98,38.12 33.98,38.12 33.22,38.88 v1(33.03,38.88)
1.5: length 33.2
  Top Layer w0.203: v1(46.1,30.94) 46.1,30.24 45.68,29.82 44.48,29.82 43.69,30.61
  Bottom Layer w0.203: v1(46.1,30.94) 45.91,31.13 45.03,31.13 43.02,29.12 36.88,29.12 35.38,30.62 35.38,45.23 无线spi.6
2.0: length 6.2
  Top Layer w0.203: 65.68,22.48 64.55,22.48 60.95,26.08
2.1: length 5.5
  Top Layer w0.203: 65.68,23.75 63.99,23.75 61.3,26.44
2.2: length 4.8
  Top Layer w0.203: 65.68,25.02 63.42,25.02 61.65,26.79
2.3: length 4
  Top Layer w0.203: 65.68,26.29 62.86,26.29 62.01,27.14
2.4: length 8
  Top Layer w0.203: 65.68,35.18 64.19,35.18 63.07,34.06 63.07,30.61 62.01,29.55
2.5: length 9.3
  Top Layer w0.203: 65.68,36.45 63.79,36.45 62.69,35.35 62.69,31.02 61.65,29.98 61.65,29.9
2.6: length 10.4
  Top Layer w0.203: 65.68,37.72 63.81,37.72 62.28,36.19 62.28,31.23 61.3,30.25
2.7: length 11.4
  Top Layer w0.203: 60.95,30.61 61.8,31.47 61.8,36.91 63.88,38.99 65.68,38.99
3.3: length 63
  Top Layer w0.203: 50.42,19.42 49.73,18.74 49.73,16.4 50.75,15.38 75.97,15.38 v1(76.15,15.21)
  Inner1 w0.203: 摄像头.12 90.49,35.21 90.49,21.22 84.66,15.38 76.32,15.38 v1(76.15,15.21)
3.4: length 34.6
  Top Layer w0.203: v1(53.41,31) 51.56,29.15 51.56,19.86 U1.49
  Bottom Layer w0.203: 陀螺仪.6 53.41,45.23 v1(53.41,31)
3.5: length 31.9
  Top Layer w0.203: U1.52 52.23,20.72 v1(52.23,27.44)
  Inner1 w0.203: v1(52.23,27.44) 36.69,27.44 32.2,31.93 屏幕.2
3.6: length 38.4
  Top Layer w0.203: 54.23,19.42 52.8,20.85 52.8,29.51 v1(54.18,30.88)
  Bottom Layer w0.203: 陀螺仪.8 62.3,49.04 58.37,49.04 54.18,44.85 v1(54.18,30.88)
3.7: length 21.9
  Top Layer w0.203: v1(53.36,25.28) 53.36,21 U1.54
  Inner1 w0.203: v1(66.23,32.64) 60.85,32.64 53.49,25.28 v1(53.36,25.28)
4.0: length 53.8
  Top Layer w0.203: v1(47.39,24.34) 45.65,26.08 45.13,26.08 44.93,25.88 44.91,25.88 44.4,25.37
  Inner1 w0.203: 编码器2.4 90.37,12.59 72.84,12.59 62.56,22.88 48.85,22.88 v1(47.39,24.34)
4.1: length 24.5
  Top Layer w0.203: U1.68 60.55,23.71 v1(60.55,23.51) ; v1(72.73,32.02) 72.73,25.04 69.16,21.48 64.59,21.48 v1(62.56,23.51)
  Inner1 w0.203: v1(60.55,23.51) v1(62.56,23.51)
  Bottom Layer w0.203: U18.1 73.55,31.69 73.23,32.02 v1(72.73,32.02)
4.2: length 35.3
  Top Layer w0.203: U1.69 61.11,23.86 61.11,21.53 65.35,17.29 83,17.29 86.31,13.99 编码器2.3
4.3: length 9.4
  Top Layer w0.203: 65.68,31.37 64.44,31.37 59.73,26.67 59.73,25.88 60.24,25.37
4.4: length 80
  Top Layer w0.203: R5.1 5,12.61 v1(5.03,12.59) ; v1(63.04,20.95) 61.92,22.07 61.92,24.46 60.6,25.78 ; 3V4.2 15.31,3.22 v1(15.31,4.34)
  Inner2 w0.203: 17.82,13.61 6.04,13.61 v1(5.03,12.59) ; 17.82,13.61 49.86,13.61 53.41,17.16 59.26,17.16 v1(63.04,20.95) ; 17.82,13.61 15.31,11.1 v1(15.31,4.34)
4.7: length 36.2
  Top Layer w0.203: 44.4,31.31 45.33,30.38 v1(45.45,30.38)
  Bottom Layer w0.203: 无线spi.10 34.87,49.8 34.87,30.5 36.67,28.7 43.77,28.7 v1(45.45,30.38)
5.0: length 41.8
  Top Layer w0.203: 51.12,18.71 50.49,18.08 v1(50.49,16.78) ; 3V8.2 22.17,3.22 v1(22.17,4.34) ; R82.1 28.93,12.53 30.11,12.53 ; 30.11,12.4 v1(30.17,12.46)
  Inner1 w0.203: v1(30.17,12.46) 30.35,12.64 32.89,12.64 ; 32.89,12.64 30.55,10.3 26.87,10.3 22.17,5.6 v1(22.17,4.34) ; 32.89,12.64 43.05,12.64 46.81,16.4 50.11,16.4 v1(50.49,16.78)
5.1: length 44.3
  Top Layer w0.203: v1(38.55,12.08) 38.48,12.16 37.23,12.16 37.15,12.08 ; 3V5.2 24.46,3.22 v1(24.46,4.34) ; U1.51 54.18,18.06 54.18,17.54 52.71,16.08 v1(50.89,16.08)
  Inner1 w0.203: v1(50.89,16.08) 47.12,16.08 43.13,12.08 42.36,12.08 ; 42.36,12.08 39.06,8.78 26.87,8.78 24.46,6.37 v1(24.46,4.34) ; 42.36,12.08 v1(38.55,12.08)
5.2: length 4
  Top Layer w0.203: 5.2.2 55.72,40.28 U1.100
5.3: length 3.8
  Top Layer w0.203: 51.12,38.09 49.25,39.96 49.25,41.07
6.0: length 47.2
  Top Layer w0.203: v1(48.57,38.04) 48.57,37.81 U1.5
  Bottom Layer w0.203: 23.95,62.63 25.22,63.9 38.94,63.9 42.49,60.34 42.49,44.47 48.57,38.39 v1(48.57,38.04)
6.1: length 24.8
  Top Layer w0.203: v1(47.78,38.01) 47.78,37.91 49.35,36.33 49.35,36.32
  Inner1 w0.203: TOF模块接口.3 34.24,46.88 34.24,42.94 37.54,39.64 46.18,39.64 47.78,38.04 v1(47.78,38.01)
6.2: length 44.6
  Top Layer w0.203: U1.7 46.92,38.04 v1(46.92,38.11)
  Bottom Layer w0.203: 23.95,60.09 25.22,61.36 38.17,61.36 41.86,57.67 41.86,44.01 46.92,38.94 v1(46.92,38.11)
6.3: length 22.2
  Top Layer w0.203: U1.8 47.06,37.2 v1(46.98,37.2)
  Inner1 w0.203: TOF模块接口.4 33.86,44.72 33.86,42.44 37.16,39.13 45.04,39.13 v1(46.98,37.2)
6.4: length 28.7
  Top Layer w0.203: 无线spi.4 36.14,43.45 36.14,27.45 40.33,23.26 42.94,23.26 44.76,25.08
6.5: length 14
  Top Layer w0.203: v1(42.49,22.62) 43.01,22.62 U1.33
  Inner1 w0.203: v1(35.87,20.42) 38.07,22.62 v1(42.49,22.62)
  Bottom Layer w0.203: 34.51,18.37 34.51,19.72 35.21,20.42 v1(35.87,20.42)
6.6: length 32.4
  Top Layer w0.203: TOF模块接口.5 34.24,43.83 35.63,42.44 35.63,26.94 40.59,21.99 43.08,21.99 45.46,24.37
6.7: length 53.4
  Top Layer w0.203: 3V7.2 17.6,3.22 v1(17.6,4.34) ; v1(45.03,19.07) 45.03,23.23 U1.35 ; v1(13.15,12.72) 12.02,12.72 ; 12.02,12.59 R71.1
  Inner1 w0.203: 18.39,13.48 13.92,13.48 v1(13.15,12.72) ; 18.39,13.48 17.6,12.69 v1(17.6,4.34) ; 18.39,13.48 42.49,13.48 45.03,16.02 v1(45.03,19.07)
7.0: length 28.7
  Top Layer w0.203: v1(53.61,26.19) 53.92,25.87 53.92,21.15 U1.55
  Inner1 w0.203: 32.2,27.96 33.73,26.43 53.36,26.43 v1(53.61,26.19)
7.1: length 30.6
  Top Layer w0.203: v1(54.06,26.82) 54.3,26.57 54.3,21.47 55.29,20.48
  Inner1 w0.203: 屏幕.3 32.2,29.61 34.93,26.88 53.99,26.88 v1(54.06,26.82)
7.2: length 18.2
  Top Layer w0.203: U1.57 54.65,21.83 54.65,24.81 v1(54.94,25.1)
  Inner1 w0.203: v1(54.94,25.1) 59.94,30.1 v1(66.29,30.1)
7.3: length 27.6
  Top Layer w0.203: 56,21.19 55.22,21.97 v1(55.22,24.33)
  Inner1 w0.203: v1(55.22,24.33) 60.12,29.23 74.5,29.23 76.06,30.79 v1(76.06,31.37)
7.4: length 51.8
  Top Layer w0.203: 有刷电机接口.1 87.32,60.22 87.96,59.58 87.96,56.79 86,54.83 68.73,54.83 67.64,53.74 67.64,43.7 61.41,37.48 61.41,31.83 U1.80
7.5: length 46.7
  Top Layer w0.203: v1(82.62,55.39) 68.78,55.39 67.13,53.74 67.13,44.09 61.03,37.99 61.03,32.16 U1.81
  Bottom Layer w0.203: v1(82.62,55.39) 82.62,58.94 有刷电机接口.5
7.6: length 46.9
  Top Layer w0.203: 有刷电机接口.2 86.43,56.53 85.85,55.95 68.83,55.95 66.62,53.74 66.62,44.34 60.65,38.37 60.65,32.49 U1.82
7.7: length 41.3
  Top Layer w0.203: 有刷电机接口.6 80.08,56.41 68.78,56.41 66.11,53.74 66.11,44.59 60.27,38.75 60.27,32.81 U1.83
8.1: length 35.7
  Top Layer w0.203: 46.13,35.92 46.93,35.92 U1.10
  Inner2 w0.203: 46.13,35.92 46.01,35.92 45.03,34.94 45.03,32.87 37.45,25.29 屏幕.5
  Bottom Layer w0.203: v1(46.16,35.94) 46.16,39.27 41.09,44.34 41.09,45.99 39.95,47.13 无线spi.5
8.2: length 23.6
  Top Layer w0.203: 47.59,34.55 46.82,35.32 45.54,35.32 43.22,37.64 37.44,37.64 v1(37.28,37.48)
  Inner1 w0.203: 屏幕.1 35.25,35.45 v1(37.28,37.48)
  Bottom Layer w0.203: v1(37.28,37.48) 37.28,40.28 39.06,42.05 无线spi.1
8.3: length 33.7
  Top Layer w0.203: v1(45.6,34.69) 45.73,34.81 46.62,34.81 U1.12
  Inner2 w0.203: v1(45.6,34.69) 45.6,32.72 35.63,22.75 屏幕.6
  Bottom Layer w0.203: 无线spi.3 45.6,38.82 v1(45.6,34.69)
8.4: length 22.3
  Top Layer w0.203: U1.13 47.39,33.34 48.5,33.34 v1(48.77,33.61)
  Inner1 w0.203: TOF模块接口.6 34.87,38.62 44.27,38.62 48.77,34.13 v1(48.77,33.61)
8.5: length 22.3
  Top Layer w0.203: v1(51.76,35.32) 49.42,32.98 47.03,32.98 U1.14
  Bottom Layer w0.203: 陀螺仪.4 51.76,48.66 v1(51.76,35.32)
8.6: length 24.4
  Top Layer w0.203: v1(51.78,34.45) 49.86,32.53 46.81,32.53 46.2,33.14 46.17,33.14
  Bottom Layer w0.203: v1(51.78,34.45) 52.65,35.32 52.65,47.01 陀螺仪.5
8.7: length 24.1
  Top Layer w0.203: U1.16 46.45,32.15 50.36,32.15 v1(51.76,33.55)
  Bottom Layer w0.203: 陀螺仪.3 50.87,50.31 50.87,34.43 v1(51.76,33.55)
9.0: length 14.6
  Top Layer w0.203: 46.17,23.61 45.59,23.03 45.59,21.08 v1(46.31,20.36) ; v1(51.13,13.99) 51.19,13.92 R41.2
  Inner1 w0.203: v1(46.31,20.36) 46.39,20.28 48.14,20.28 51.51,16.91 51.51,14.37 v1(51.13,13.99)
9.1: length 15.9
  Top Layer w0.203: R42.2 52.15,12.34 v1(51.13,12.34) ; U1.37 46.02,22.8 46.02,21.51 46.65,20.88 v1(47,20.88)
  Inner1 w0.203: v1(51.13,12.34) 51.89,13.1 51.89,17.03 48.05,20.88 v1(47,20.88)
9.2: length 40.1
  Top Layer w0.203: U1.38 48.6,24.68 v1(48.6,28)
  Inner1 w0.203: v1(48.6,28) 48.6,29.48 67.76,48.64 67.76,52.47 v1(69.16,53.86)
9.3: length 38.8
  Top Layer w0.203: U1.39 49.16,24.53 v1(49.16,28.57)
  Inner1 w0.203: v1(69.23,52.29) 68.15,51.21 68.15,48.43 49.16,29.45 v1(49.16,28.57)
9.4: length 37.4
  Top Layer w0.203: U1.40 49.79,24.45 v1(49.79,28)
  Inner1 w0.203: v1(69.23,50.73) 68.53,50.03 68.53,48.31 49.79,29.57 v1(49.79,28)
9.5: length 36.1
  Top Layer w0.203: v1(50.39,28.49) 50.39,24.35 U1.41
  Inner1 w0.203: v1(50.39,28.49) 50.39,29.63 69.23,48.47 v1(69.23,49.2)
9.6: length 34.8
  Top Layer w0.203: U1.42 51,24.25 v1(51,28.02)
  Inner1 w0.203: v1(69.23,47.68) 51,29.45 v1(51,28.02)
9.7: length 45.2
  Top Layer w0.203: v1(45.64,18.18) 45.64,18.18 48.65,21.19 ; v1(19.89,4.34) 19.89,3.22 3V6.2 ; v1(21.66,12.46) 21.66,12.47 R50.1
  Inner1 w0.203: 25.04,13.05 22.25,13.05 v1(21.66,12.46) ; 25.04,13.05 19.89,7.89 v1(19.89,4.34) ; 25.04,13.05 42.82,13.05 45.64,15.87 v1(45.64,18.18)
A.0: length 72.9
  Top Layer w0.203: v1(57.03,20.27) 57.03,20.86 U1.59
  Inner1 w0.203: v1(57.03,20.27) 49.16,20.27 45.58,23.85 31.86,23.85 30.3,25.42 30.3,56.91 29.33,57.88 v1(24.6,57.88)
  Bottom Layer w0.203: v1(24.6,57.88) 24.6,57.18 22.3,54.88 R46.2
A.1: length 28.6
  Top Layer w0.203: R21.2 79.19,11.06 79.19,13.73 77.16,15.77 64.34,15.77 59.76,20.34 58.27,20.34 56.71,21.89
A.2: length 73.3
  Top Layer w0.203: U1.61 58.37,20.94 v1(58.52,20.94)
  Inner1 w0.203: v1(23.82,58.44) 29.28,58.44 30.81,56.91 30.81,27.58 31.95,26.43 32.84,26.43 33.94,25.33 44.74,25.33 49.12,20.94 v1(58.52,20.94)
  Bottom Layer w0.203: R61.2 22.81,56.41 23.82,57.42 v1(23.82,58.44)
A.3: length 29.3
  Top Layer w0.203: R22.2 80.83,12.86 77.54,16.15 64.72,16.15 58.77,22.1 57.92,22.1 U1.62
A.5: length 32.6
  Top Layer w0.203: U1.64 64.9,16.53 80.85,16.53 84.58,12.79 R62.2
A.7: length 33.7
  Top Layer w0.203: R63.2 86.11,12.02 81.23,16.91 65.1,16.91 60.27,21.73 60.27,22.57 58.83,24.02
B.6: length 34.9
  Top Layer w0.203: v1(59.51,35.2) 57.7,35.2 57.06,34.55
  Inner1 w0.203: 摄像头.6 82.88,35.2 v1(59.51,35.2)
B.7: length 34.5
  Top Layer w0.203: v1(59,35.76) 57.66,35.76 56.81,34.91 56.71,34.91
  Inner1 w0.203: v1(59,35.76) 84.85,35.76 摄像头.8
CC1: length 4.2
  Top Layer w0.203: USB1.4 44.99,8.32 43.76,9.54 R4.2
CC2: length 4
  Top Layer w0.203: R14.2 48.71,9.16 47.99,8.43 USB1.10
CORE_VCC: length 18.7
  Top Layer w0.203: C111.2 57.15,36.75 57.15,36.03 52.93,31.82 46.02,31.82 44.89,32.95 44.89,32.98 44.83,33.04 44.83,34.44 C1.2
D+: length 15.9
  Top Layer w0.203: v1(52.21,8.6) 52.21,7.19 52.78,6.62 P2.2 ; USB1.6 45.97,7.5 45.97,6.82 46.24,6.55 46.75,6.55 46.99,6.79 USB1.8 47.02,7.55 v1(47.02,11.19)
  Inner1 w0.203: v1(47.02,11.19) 49.61,8.6 v1(52.21,8.6)
D-: length 15.6
  Top Layer w0.203: USB1.7 46.49,8.34 46.17,8.65 45.92,8.65 ; USB1.5 45.52,7.56 45.52,8.38 45.79,8.65 45.92,8.65 ; 45.92,8.65 45.92,9.42 45.32,10.02 v1(45.32,11.26) ; v1(51.13,9.16) P2.1
  Inner1 w0.203: v1(45.32,11.26) 45.89,11.83 47.32,11.83 49.98,9.16 v1(51.13,9.16)
FB3: length 6.5
  Bottom Layer w0.635: R38.1 22.68,23.26 21.69,24.25 v1(21.69,26.38)
HREF: length 16.7
  Bottom Layer w0.203: 88.85,33.93 85.53,30.61 U18.2
P1.6: length 7.1
  Top Layer w0.203: X1.3 40.03,35.56 39.62,35.15 39.62,34.57 41.14,33.04 41.8,33.04 42.17,32.68 ; 43.34,30.38 43.34,30.4 42.67,31.07 42.67,32.18 42.3,32.55
P1.7: length 4.6
  Top Layer w0.203: X1.1 39.7,32.56 41,31.25 41.16,31.25 41.65,30.76 42.22,30.76 42.99,29.99 42.99,30.03
P3.0: length 9.4
  Top Layer w0.203: U1.45 46.68,17.81 46.68,15.13 45.32,13.77 R11.2
P3.1: length 8.5
  Top Layer w0.203: R15.2 47.06,12.81 47.06,17.48 U1.46
P3.2: length 34.7
  Top Layer w0.203: v1(71.41,7.49) 71.41,12.25 68.65,15 50.49,15 49.35,16.15 49.35,19.07 50.03,19.75 50.06,19.72
  Bottom Layer w0.203: R12.1 71.44,5.28 71.44,7.46 v1(71.41,7.49)
P5.4: length 53.7
  Top Layer w0.203: U1.27 43.63,27.49 43.63,28.37 44.04,28.77 44.71,28.77 v1(47.64,25.83) ; v1(72.59,7.64) 72.66,7.57 SW31.2 SW31.1 72.66,1.47 v1(72.72,1.41)
  Inner1 w0.203: v1(72.59,7.64) 72.59,12.34 63.33,21.6 48.98,21.6 46.81,23.77 46.81,25 v1(47.64,25.83)
  Bottom Layer w0.203: v1(72.72,1.41) 74.05,1.41 ; R29.2 73.74,7.64 v1(72.59,7.64)
PCLK: length 18.8
  Top Layer w0.203: 75.68,32.64 75.74,32.58 ; U3.9 v1(78.31,32.66)
  Inner1 w0.203: 摄像头.2 87.83,25.16 87.83,28.47 83.64,32.66 v1(78.31,32.66)
UCAP: length 2.5
  Top Layer w0.203: C7.2 41.02,26.81 42.25,26.81 U1.26
VREF: length 2.1
  Top Layer w0.203: 43.69,26.08 42.44,24.83 42.44,24.58 v1(42.4,24.54)
WE: length 5.9
  Bottom Layer w0.203: v1(76.06,27.56) 76.04,27.58 73.11,27.58 71.87,28.82 71.87,29.96
$1N37511: length 7.2
  Top Layer w0.203: SW45.1 SW45.2 v3(68.01,7.52)
  Bottom Layer w0.203: R13.1 68.02,7.51 v3(68.01,7.52)
$2N8: length 2.6
  Top Layer w0.203: U17.6 24.6,26.38 25.41,27.19 C36.2
$2N11: length 5
  Top Layer w0.508: U17.2 22.64,30.32 v1(22.61,30.35)
  Bottom Layer w0.508: v1(22.61,30.35) 24.66,30.35 L1.2
  vias: v1(25.41,29.06)
$2N35: length 1.5
  Top Layer w0.381: R30.2 24.26,54.75 R31.1
$2N37: length 1.6
  Top Layer w0.381: R28.2 22.96,51.36
$2N39:
  vias: v1(20.27,45.1)
$2N40: length 1.7
  Top Layer w0.381: U9.6 24.42,49.69 R28.1
$2N41: length 6.8
  Top Layer w0.381: R31.2 25.76,54.74 R32.1 25.69,52.96 U9.5
$2N42: length 2
  Top Layer w0.254: R27.2 27.36,42.23 U9.4
$2N43: length 2.4
  Top Layer w0.381: 21.52,42.15 20.74,42.15 20.25,42.64 v1(20.25,43.59)
$2N45:
  vias: v1(22.95,38.71) v1(22.95,38.08) v1(23.58,38.71) v1(23.58,38.08)
$2N49: length 15.2
  Bottom Layer w0.254: U6.3 7.19,15.26 10.74,18.81 v1(10.74,25.29)
$2N1711: length 1.5
  Top Layer w0.381: R67.1 10.87,53.73 9.34,53.73
$2N1712: length 1.7
  Top Layer w0.381: U20.6 11.16,47.06 R65.1
$2N1713: length 6.7
  Top Layer w0.381: U20.5 R68.1 R67.2
$2N1714: length 1.9
  Top Layer w0.254: v1(12.39,40.02) 12.39,41.19 U20.4
  Bottom Layer w0.254: R64.2 v1(12.39,40.02)
$2N1715: length 1.6
  Top Layer w0.381: R65.2 9.66,50.31 C48.1
$2N1716: length 3.5
  Top Layer w0.381: v1(7.44,41.17) 7.47,41.19 U20.1
  Bottom Layer w0.381: v1(7.44,41.17) C47.2
$2N1717:
  vias: v1(7.44,44.91)
$2N1720:
  vias: v1(10.23,36.72) v1(10.23,36.08) v1(10.87,36.72) v1(10.87,36.08)
$2N1728: length 5.4
  Top Layer w0.635: U6.2 3.88,17.8 6.8,14.88 Q2.4
$3N54: length 1.8
  Bottom Layer w0.635: Q1.3 18.74,7.02 CN1.2
$3N83: length 2.6
  Bottom Layer w0.203: 舵机1.3 18.74,54.88 R46.1
$3N93: length 4.5
  Top Layer w0.203: 80.83,9.54 80.83,5.21 电调接口/涵道#2.2
$3N95: length 4.9
  Top Layer w0.203: 电调接口/涵道#2.1 78.18,6.75 79.19,7.75 79.19,9.54
$3N132: length 2.5
  Bottom Layer w0.203: Q1.1 17.79,12.02 18.23,12.46 v1(18.88,12.46)
$3N199: length 1.7
  Bottom Layer w0.635: Q4.3 35.65,8.65 CN7.2
$3N202: length 2.1
  Bottom Layer w0.203: v1(35.63,12.08) 35.13,12.08 34.68,11.64 Q4.1
$3N204: length 1.8
  Bottom Layer w0.635: Q5.3 27.14,8.78 CN8.2
$3N207: length 2.6
  Bottom Layer w0.203: Q5.1 26.17,12.15 26.49,12.46 v1(27.26,12.46)
$3N271: length 50
  Top Layer w0.203: v1(74.24,53.86) 74.22,53.84 R54.1
  Inner1 w0.203: v1(74.24,53.86) 74.24,57.8 71.32,60.72 37.12,60.72 v1(34.11,57.71)
$3N278: length 41.3
  Top Layer w0.203: 74.27,52.3 74.22,52.25 v1(73.5,52.25) 70.81,52.25 R7.1
  Inner1 w0.203: v1(73.5,52.25) 73.5,57.78 71.07,60.22 45.67,60.22 v1(43.25,57.8)
$3N279: length 32.5
  Top Layer w0.203: 74.27,50.79 74.2,50.73 v1(72.86,50.73) R8.1
  Inner1 w0.203: v1(72.86,50.73) 72.86,57.78 70.94,59.71 54.52,59.71 v1(52.52,57.71)
$3N280: length 23.5
  Top Layer w0.203: R9.1 v1(72.23,49.2) 74.27,49.2
  Inner1 w0.203: v1(61.8,57.71) 63.15,59.07 70.81,59.07 72.23,57.66 v1(72.23,49.2)
$3N281: length 13.8
  Top Layer w0.203: 74.27,47.65 71.62,47.65 v1(71.59,47.68) R10.1
  Inner1 w0.203: v1(71.07,57.71) 71.59,57.19 v1(71.59,47.68)
$3N297: length 12.1
  Bottom Layer w0.203: 舵机2.3 9.56,57 19.3,57 R61.1
$3N300: length 4.9
  Top Layer w0.203: 电调接口/涵道.2 87.2,6.88 86.11,7.96 R63.1
$3N302: length 4.5
  Top Layer w0.203: 电调接口/涵道.1 84.66,9.48 R62.1
$3N307: length 1.8
  Bottom Layer w0.635: CN2.2 1.72,7.02 Q6.3
$3N309: length 3
  Bottom Layer w0.203: Q6.1 0.77,11.89 1.6,12.72 v1(2.36,12.72)
$3N312: length 1.9
  Bottom Layer w0.635: CN3.2 10.25,8.9 Q7.3
$3N314: length 2.6
  Top Layer w0.203: R71.2 10.48,12.61 v1(10.45,12.59)
  Bottom Layer w0.203: v1(10.45,12.59) 9.73,12.59 9.28,12.15 Q7.1
$3N325:
  vias: v1(15.25,0.92)
$3N327:
  vias: v1(17.53,0.92)
$3N329:
  vias: v1(22.17,1.03)
$3N331:
  vias: v1(24.47,0.88)
$3N333:
  vias: v1(19.85,0.99)
$4N26: length 16.8
  Top Layer w0.203: 摄像头.15 90.37,40.4 88.34,40.4 86.94,39.01 U3.14
$4N27: length 16.3
  Top Layer w0.203: U3.13 88.61,37.74 88.62,37.75 89.58,37.75 89.59,37.74 90.24,37.74 摄像头.13
$4N29: length 16.7
  Top Layer w0.203: 摄像头.11 90.37,35.32 88.08,35.32 86.94,36.47 U3.12
$4N31: length 17.1
  Top Layer w0.203: 摄像头.9 90.5,32.91 89.59,32.91 89.58,32.9 88.62,32.9 88.61,32.91 87.7,32.91 85.42,35.2 U3.11
$4N33: length 17.9
  Top Layer w0.203: U3.4 84.27,26.31 88.21,30.24 90.5,30.24 91.64,31.39 摄像头.7
$4N35: length 17.3
  Top Layer w0.203: U3.3 85.93,25.04 88.59,27.7 90.37,27.7 摄像头.5
$4N37: length 16.8
  Top Layer w0.203: 摄像头.3 90.24,25.04 89.59,25.04 89.58,25.05 88.62,25.05 88.61,25.04 88.08,25.04 86.81,23.77 U3.2
$4N39: length 16.8
  Top Layer w0.203: 75.94,22.5 91.13,22.5 91.64,23 摄像头.1
$4N50: length 15.2
  Top Layer w0.203: R42.1 54.62,12.27 55.57,13.22 61.16,13.22 61.8,12.59 v1(61.8,9.29)
  Bottom Layer w0.203: SW1.2 v1(61.8,9.29) 60.75,9.29
$4N51: length 13.5
  Top Layer w0.203: R41.1 61.61,13.92 62.56,12.97 v1(62.56,11.83)
  Bottom Layer w0.203: R23.2 62.53,11.8 v1(62.56,11.83) SW1.1
$4N55: length 1.5
  Bottom Layer w0.203: R52.2 34.5,17.04 35.99,17.04
$4N56: length 3.5
  Bottom Layer w0.203: BUZZER1.2 39.57,17.67 39.25,17.99 Q3.3
$4N65:
  vias: v1(49.2,43.3)
$4N66:
  vias: v1(84.27,48.28)
$4N67:
  vias: v1(84.31,45.84)
$4N68:
  vias: v1(12.52,61.87)
$4N269:
  vias: v1(8.77,61.83)
$4N275:
  vias: v1(55.72,43.39)

## Copper pours and planes (outline as drawn; the poured copper is in the pictures)
AGND on Top Layer: -27.87,81.04 108.15,81.04 108.15,-12.18 -27.87,-12.18
AGND on Bottom Layer: -27.99,82.57 119.07,82.57 119.07,-12.94 -27.99,-12.94
AGND on Inner1: -28.63,86.5 126.69,86.5 126.69,-19.29 -28.63,-19.29
AGND on Inner2: -28.12,82.44 116.41,82.44 116.41,-11.92 -28.12,-11.92
GND on Top Layer: -10.47,57.17 29.63,57.17 29.63,13.93 -10.47,13.93
GND on Bottom Layer: -10.59,57.17 29.63,57.17 29.63,13.93 -10.59,13.93
GND on Inner1: -10.47,57.17 29.63,57.17 29.63,13.93 -10.47,13.93
GND on Inner2: -10.72,57.29 29.63,57.29 29.63,13.93 -10.72,13.93
VCC3V3 on Top Layer: 76.67,54.66 76.67,46.61 74.98,46.61 74.98,54.66
VCC7.4 on Top Layer: 5.92,53.12 10.19,53.12 10.19,51.08 5.92,51.08
VCC7.4V on Top Layer: 18.36,53.99 18.38,54.01 23.44,54.01 23.44,52.85 21.58,50.98 18.36,50.98
VCCBAT on Top Layer: 13.79,36 13.87,36.08 18.52,36.08 18.52,14.11 8.71,14.11 8.71,20.97 13.79,26.05
0.0 on Top Layer: 40.12,36.81 40.16,36.81 43.91,33.05 41.01,30.15 37.23,33.92
0.0 on Bottom Layer: 40.12,36.81 40.16,36.81 43.91,33.05 41.01,30.15 37.23,33.92
0.0 on Inner1: 40.12,36.81 40.16,36.81 43.91,33.05 41.01,30.15 37.23,33.92
0.0 on Inner2: 40.12,36.81 40.16,36.81 43.91,33.05 41.01,30.15 37.23,33.92
$2N38 on Top Layer: 13.52,38.07 13.52,53.53 17.2,53.53 17.2,38.07
$2N39 on Top Layer: 20.83,44.17 17.34,44.17 17.34,48.23 19.38,48.25 19.91,48.78 22.33,48.78 22.33,47.34 20.88,47.34 20.83,47.29
$2N45 on Top Layer: 19.61,33.09 19.61,35.15 21.52,35.15 21.6,35.23 21.6,42.83 25.2,42.83 25.2,33.09
$2N48 on Top Layer: 0.78,27.27 8.47,27.27 8.47,15.64 7.19,15.64 3.95,18.87 0.78,18.87
$2N1717 on Top Layer: 9.22,47.77 9.22,46.62 8.24,45.64 8.24,42.82 4.9,42.82 4.9,45.61 7.06,47.77
$2N1719 on Top Layer: 0.84,54.37 4.39,54.37 4.39,36.28 0.84,36.28
$2N1720 on Top Layer: 8.28,42.05 11.76,42.05 11.76,27.45 8.28,27.45

Small or netless copper shapes (teardrops, artwork), in the pictures only: 379 on Top Layer, 179 on Bottom Layer, 86 on Inner1, 8 on Inner2

## Text on the board
Top Layer: 杭科院 / 大运号 / 2026/7/6
